# Altium schematic sheet I2C-sensors.SchDoc
size A4
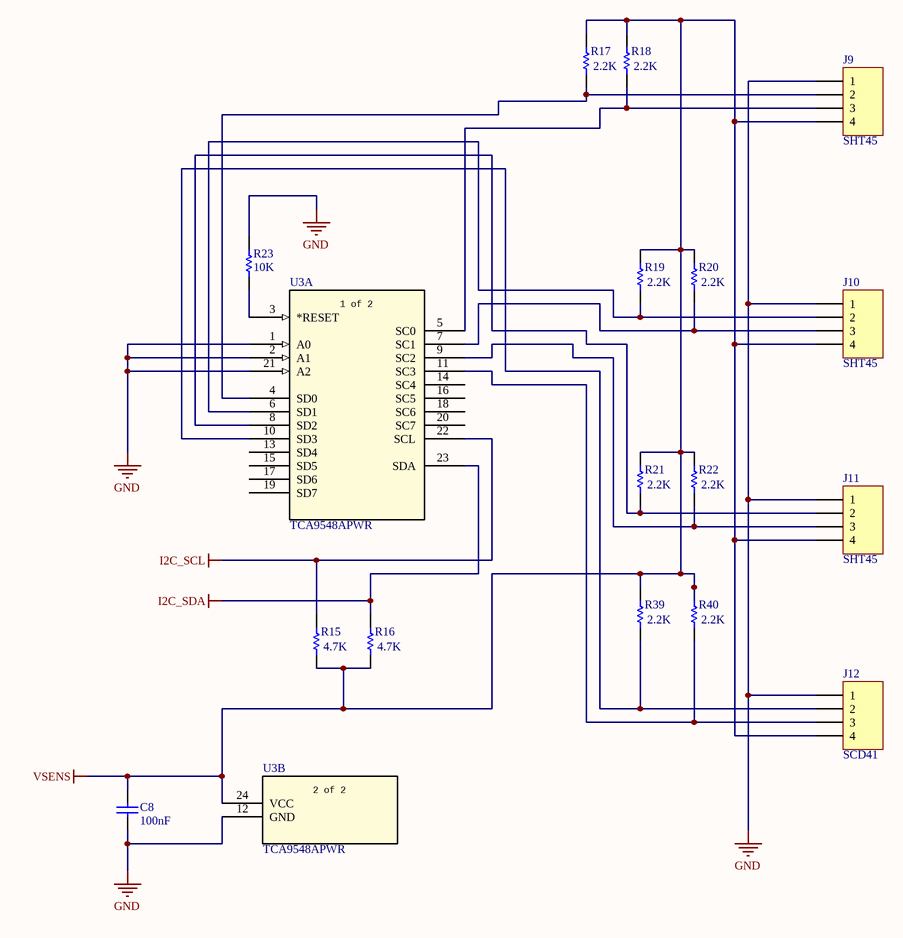
[diagram p0: I2C-sensors.SchDoc]

## Parts
C8  100nF  [CHIP0805-M]
J9  SHT45  [PHX-MC15-4-G-35]
J10  SHT45  [PHX-MC15-4-G-35]
J11  SHT45  [PHX-MC15-4-G-35]
J12  SCD41  [PHX-MC15-4-G-35]
R15  value 4.7K  [CHIP0805-M]  (hidden comment: pullup)
R16  value 4.7K  [CHIP0805-M]  (hidden comment: pullup)
R17  value 2.2K  [CHIP0805-M]  (hidden comment: pullup)
R18  value 2.2K  [CHIP0805-M]  (hidden comment: pullup)
R19  value 2.2K  [CHIP0805-M]  (hidden comment: pullup)
R20  value 2.2K  [CHIP0805-M]  (hidden comment: pullup)
R21  value 2.2K  [CHIP0805-M]  (hidden comment: pullup)
R22  value 2.2K  [CHIP0805-M]  (hidden comment: pullup)
R23  value 10K  [CHIP0805-M]  (hidden comment: 220R)
R39  value 2.2K  [CHIP0805-M]  (hidden comment: pullup)
R40  value 2.2K  [CHIP0805-M]  (hidden comment: pullup)
U3  TCA9548APWR  [PW24_TEX]  (parts A,B of 2)

## Nets
GND: C8.2 J9.1 J10.1 J11.1 J12.1 R23.1 U3.1(A0) U3.2(A1) U3.12(GND) U3.21(A2)
I2C_SCL: R15.2 U3.22(SCL)
I2C_SDA: R16.2 U3.23(SDA)
VSENS: C8.1 J9.4 J10.4 J11.4 J12.4 R15.1 R16.1 R17.2 R18.2 R19.2 R20.2 R21.2 R22.2 R39.2 R40.2 U3.24(VCC)
NetJ9_2: J9.2 R17.1 U3.4(SD0)
NetJ9_3: J9.3 R18.1 U3.5(SC0)
NetJ10_2: J10.2 R19.1 U3.6(SD1)
NetJ10_3: J10.3 R20.1 U3.7(SC1)
NetJ11_2: J11.2 R21.1 U3.8(SD2)
NetJ11_3: J11.3 R22.1 U3.9(SC2)
NetJ12_2: J12.2 R39.1 U3.10(SD3)
NetJ12_3: J12.3 R40.1 U3.11(SC3)
NetR23_2: R23.2 U3.3(*RESET)

Not connected (* = marked no-connect by the designer): U3 13(SD4) 14(SC4) 15(SD5) 16(SC5) 17(SD6) 18(SC6) 19(SD7) 20(SC7)

## Notes on the sheet
- (in symbol TCA9548APWR, part A) 1 of 2
- (in symbol TCA9548APWR, part B) 2 of 2

## Library data of the parts
C8 = Cap: Capacitor; Published: 8-Jun-2000; LatestRevisionDate: 17-Jul-2002; LatestRevisionNote: Re-released for DXP Platform.; PackageReference: RAD-0.3; Publisher: Altium Limited; PackageDescription: Radial Cap, Thru-Hole; 2 Leads; 0.3 in Pin Spacing; Value: 100nF
J9-J12 = Header 4: Header, 4-Pin; LatestRevisionDate: 17-Jul-2002; LatestRevisionNote: Re-released for DXP Platform.; Publisher: Altium Limited
R15-R23 R39 R40 = Res1: Resistor; Published: 8-Jun-2000; LatestRevisionDate: 17-Jul-2002; LatestRevisionNote: Re-released for DXP Platform.; PackageReference: AXIAL-0.3; Publisher: Altium Limited; PackageDescription: Axial Device, Thru-Hole; 2 Leads; 0.3 in Pin Spacing
U3 = TCA9548APWR: 8-channel 1.65- to 5.5-V I2C/SMBus switch with reset & voltage translation 24-TSSOP -40 to 85; Manufacturer_Name: Texas Instruments; Copyright: Copyright (C) 2025 Ultra Librarian. All rights reserved.; Manufacturer_Part_Number: TCA9548APWR; RefDes: RefDes; Type: Type